# Altium schematic sheet 1.mcuv4.SchDoc
size A3; DocumentNumber: 2; SheetNumber: 2; SheetTotal: 4; PageSetup: Record=PageOptions|CenterHorizontal=True|CenterVertical=True|PrintScale=0.73|XCorrection=1.00|YCorrection=1.00|PrintKind=1|BorderSize=5000000|LeftOffset=0|BottomOffset=0|Orientation=2|PaperLength=1000|PaperWidth=1000|Scale=100|PaperSource=7|PrintQuality=-3|MediaType=1|DitherType=10|PrintScaleMode=1|PaperKind=A4|PaperIndex=9
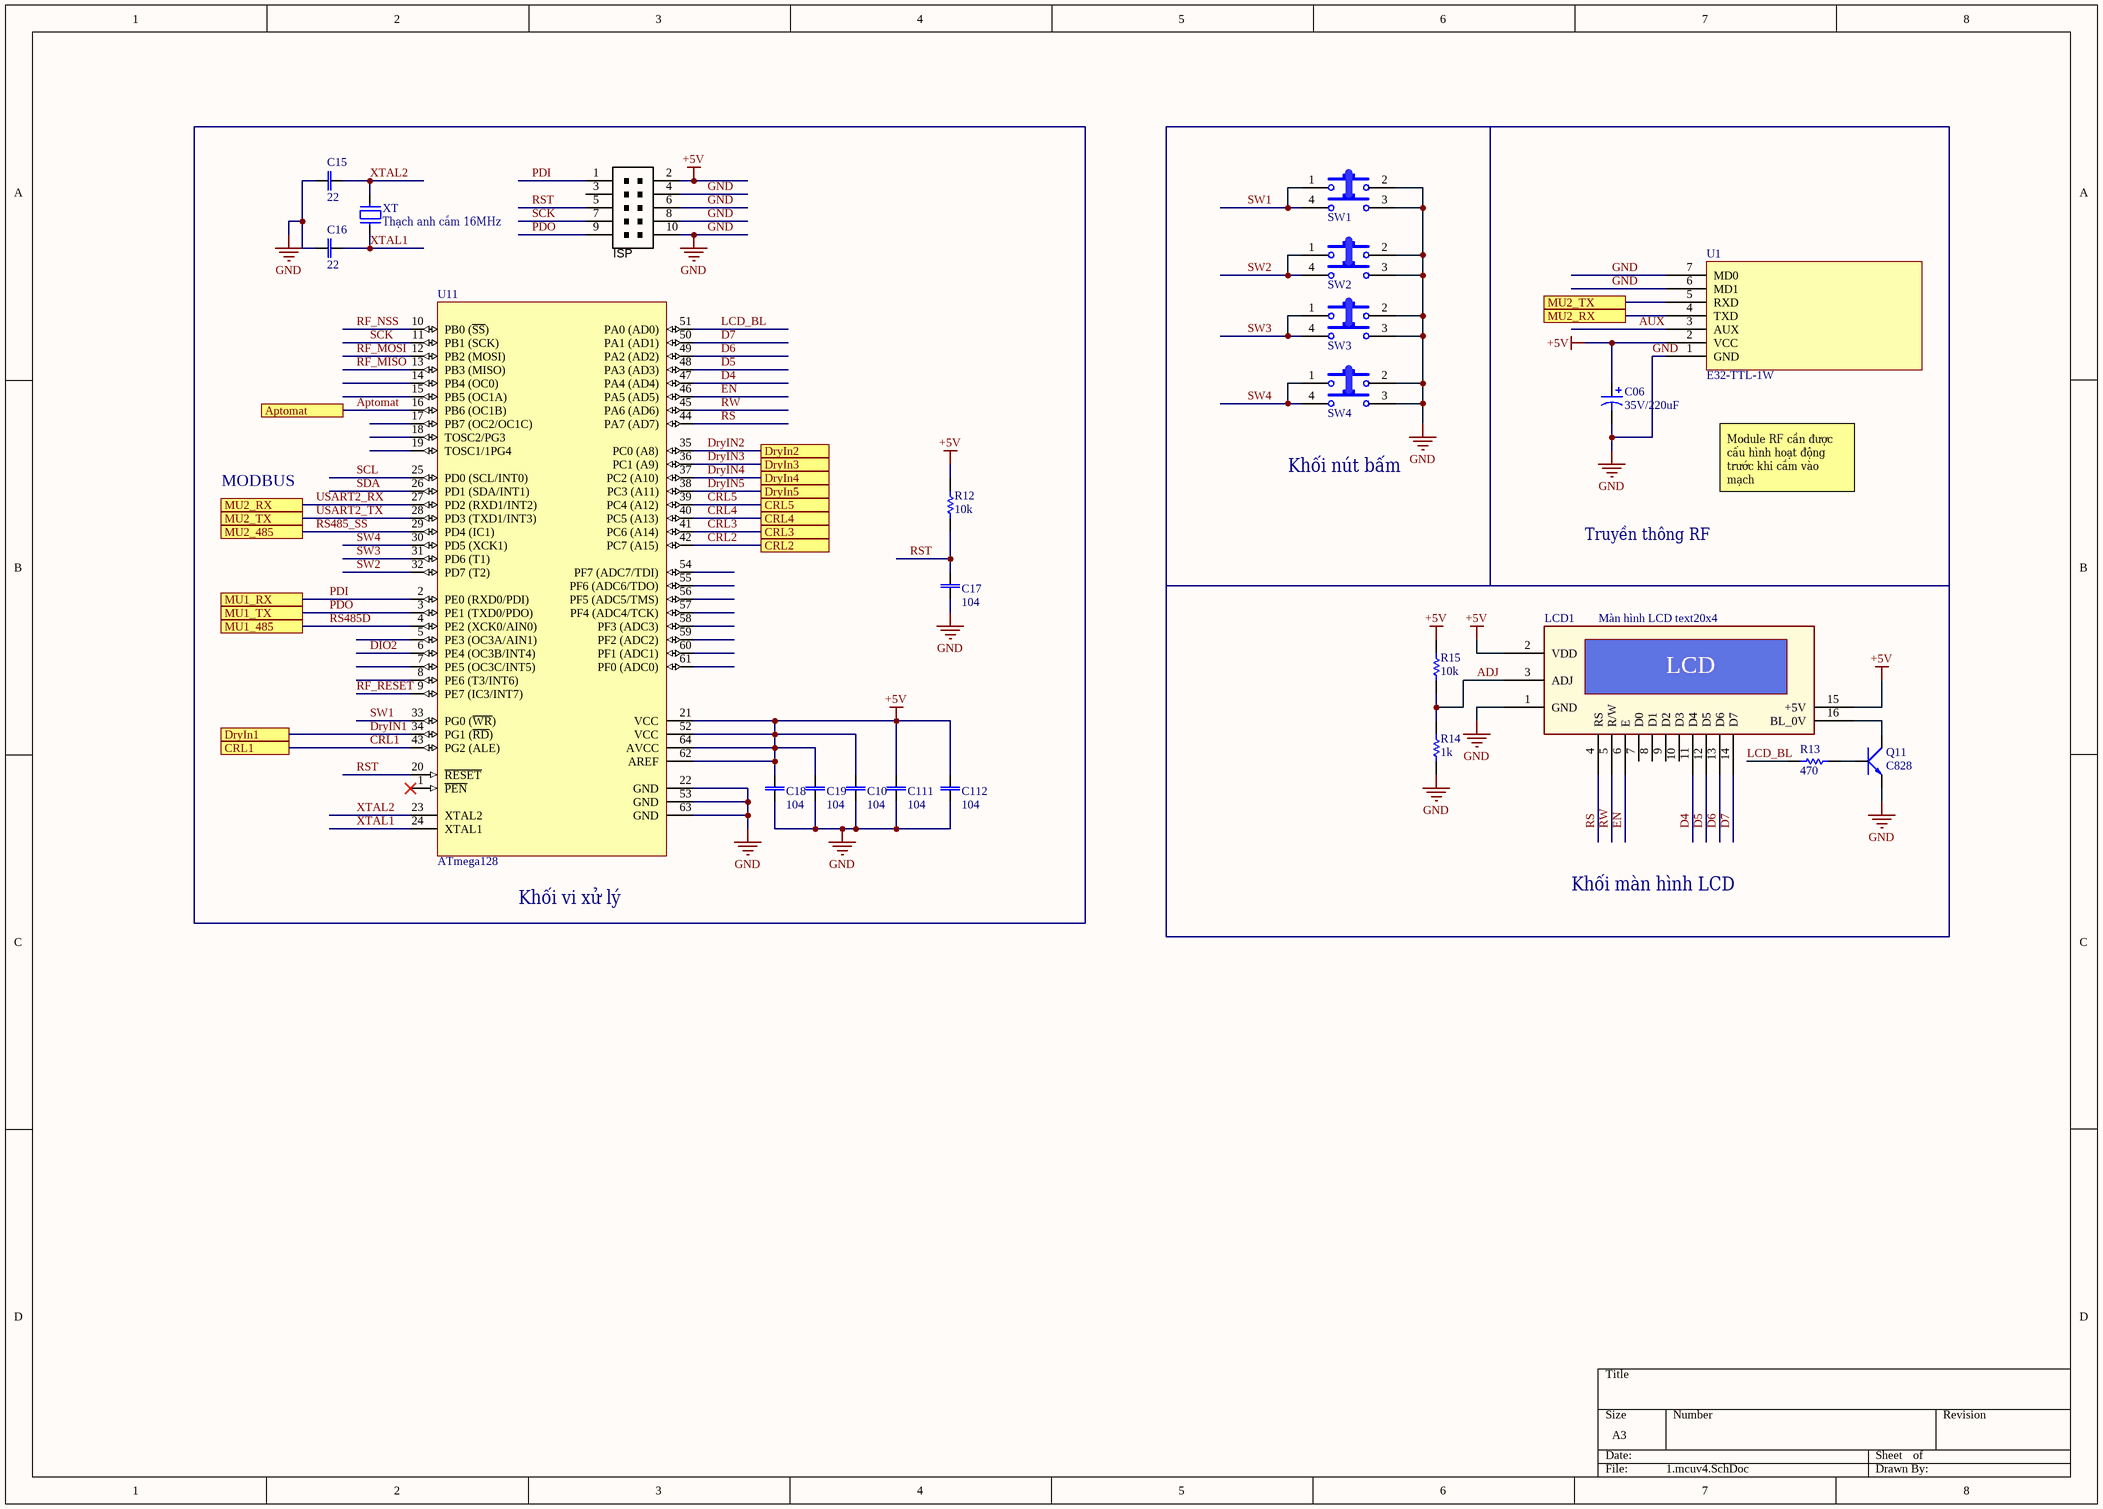
[diagram p0: 1.mcuv4.SchDoc]

## Parts
C06  value 35V/220uF  [CAPE3.5-5.0MM_Rad_10x14mm]  (hidden comment: Tụ nhôm cắm35V/220uF)
C10  value 104  [CAP 0805]  (hidden comment: Tụ điện dán 0805104)
C15  value 22  [CAP 0805]  (hidden comment: Tụ điện dán 080522)
C16  value 22  [CAP 0805]  (hidden comment: Tụ điện dán 080522)
C17  value 104  [CAP 0805]  (hidden comment: Tụ điện dán 0805104)
C18  value 104  [CAP 0805]  (hidden comment: Tụ điện dán 0805104)
C19  value 104  [CAP 0805]  (hidden comment: Tụ điện dán 0805104)
C111  value 104  [CAP 0805]  (hidden comment: Tụ điện dán 0805104)
C112  value 104  [CAP 0805]  (hidden comment: Tụ điện dán 0805104)
ISP  Giắc đôi 5x2 chân 2.54mm  [10P_PCB_HEADER_BRD_MNT]  (value not drawn)
LCD1  Màn hình LCD text20x4  [LCD 20x4]
Q11  C828  [SOT23 TOP]
R12  value 10k  [RES 0805]  (hidden comment: Điện trở dán 080510k)
R13  value 470  [RESC1608N_F]  (hidden comment: Điện trở dán 0805470)
R14  value 1k  [RES 0805]  (hidden comment: Điện trở dán 08051k)
R15  value 10k  [RES 0805]  (hidden comment: Điện trở dán 080510k)
SW1  Nút bấm 4 chân cắm12x12x17mm  [SW 12x12x4]  (value not drawn)
SW2  Nút bấm 4 chân cắm12x12x17mm  [SW 12x12x4]  (value not drawn)
SW3  Nút bấm 4 chân cắm12x12x17mm  [SW 12x12x4]  (value not drawn)
SW4  Nút bấm 4 chân cắm12x12x17mm  [SW 12x12x4]  (value not drawn)
U1  value E32-TTL-1W  [RF_AS32]
U11  ATmega128  [64A_N]
XT  Thạch anh cắm 16MHz  [XT2]

## Blocks framed on the sheet
Khối vi xử lý: C10 C15-C19 C111 C112 ISP R12 U11 XT

## Ports
Aptomat, CRL1, CRL2, CRL3, CRL4, CRL5, DryIn1, DryIn2, DryIn3, DryIn4, DryIn5, MU1_485, MU1_RX, MU1_TX, MU2_485, MU2_RX, MU2_TX

## Nets
+5V: C06.1 C10.2 C18.2 C19.2 C111.2 C112.2 ISP.2 LCD1.2(VDD) LCD1.15(+5V) R12.2 R15.2 U1.2(VCC) U11.21(VCC) U11.52(VCC) U11.62(AREF) U11.64(AVCC)
GND: C06.2 C10.1 C15.2 C16.2 C17.1 C18.1 C19.1 C111.1 C112.1 ISP.4 ISP.6 ISP.8 ISP.10 LCD1.1(GND) Q11.3(E) R14.1 SW1.2 SW1.3 SW2.2 SW2.3 SW3.2 SW3.3 SW4.2 SW4.3 U1.1(GND) U1.6(MD1) U1.7(MD0) U11.22(GND) U11.53(GND) U11.63(GND)
ADJ: LCD1.3(ADJ) R14.2 R15.1
Aptomat: U11.16(PB6_(OC1B)) ; port Aptomat
AUX: U1.3(AUX)
CRL1: U11.43(PG2_(ALE)) ; port CRL1
CRL2: U11.42(PC7_(A15)) ; port CRL2
CRL3: U11.41(PC6_(A14)) ; port CRL3
CRL4: U11.40(PC5_(A13)) ; port CRL4
CRL5: U11.39(PC4_(A12)) ; port CRL5
D4: LCD1.11(D4) U11.47(PA4_(AD4))
D5: LCD1.12(D5) U11.48(PA3_(AD3))
D6: LCD1.13(D6) U11.49(PA2_(AD2))
D7: LCD1.14(D7) U11.50(PA1_(AD1))
DIO2: U11.6(PE4_(OC3B/INT4))
DryIN1: U11.34(PG1_(~{RD})) ; port DryIn1
DryIN2: U11.35(PC0_(A8)) ; port DryIn2
DryIN3: U11.36(PC1_(A9)) ; port DryIn3
DryIN4: U11.37(PC2_(A10)) ; port DryIn4
DryIN5: U11.38(PC3_(A11)) ; port DryIn5
EN: LCD1.6(E) U11.46(PA5_(AD5))
LCD_BL: R13.2 U11.51(PA0_(AD0))
PDI: ISP.1 U11.2(PE0_(RXD0/PDI)) ; port MU1_RX
PDO: ISP.9 U11.3(PE1_(TXD0/PDO)) ; port MU1_TX
RF_MISO: U11.13(PB3_(MISO))
RF_MOSI: U11.12(PB2_(MOSI))
RF_NSS: U11.10(PB0_(~{SS}))
RF_RESET: U11.9(PE7_(IC3/INT7))
RS: LCD1.4(RS) U11.44(PA7_(AD7))
RS485_SS: U11.29(PD4_(IC1)) ; port MU2_485
RS485D: U11.4(PE2_(XCK0/AIN0)) ; port MU1_485
RST: C17.2 ISP.5 R12.1 U11.20(~{RESET})
RW: LCD1.5(R/W) U11.45(PA6_(AD6))
SCK: ISP.7 U11.11(PB1_(SCK))
SCL: U11.25(PD0_(SCL/INT0))
SDA: U11.26(PD1_(SDA/INT1))
SW1: SW1.1 SW1.4 U11.33(PG0_(~{WR}))
SW2: SW2.1 SW2.4 U11.32(PD7_(T2))
SW3: SW3.1 SW3.4 U11.31(PD6_(T1))
SW4: SW4.1 SW4.4 U11.30(PD5_(XCK1))
USART2_RX: U1.4(TXD) U11.27(PD2_(RXD1/INT2)) ; port MU2_RX
USART2_TX: U1.5(RXD) U11.28(PD3_(TXD1/INT3)) ; port MU2_TX
XTAL1: C16.1 U11.24(XTAL1) XT.1
XTAL2: C15.1 U11.23(XTAL2) XT.2
NetLCD1_16: LCD1.16(BL_0V) Q11.2(C)
NetQ11_1: Q11.1(B) R13.1

Not connected (* = marked no-connect by the designer): ISP 3; LCD1 7(D0) 8(D1) 9(D2) 10(D3); U11 1(~{PEN})* 5(PE3_(OC3A/AIN1)) 7(PE5_(OC3C/INT5)) 8(PE6_(T3/INT6)) 14(PB4_(OC0)) 15(PB5_(OC1A)) 17(PB7_(OC2/OC1C)) 18(TOSC2/PG3) 19(TOSC1/1PG4) 54(PF7_(ADC7/TDI)) 55(PF6_(ADC6/TDO)) 56(PF5_(ADC5/TMS)) 57(PF4_(ADC4/TCK)) 58(PF3_(ADC3)) 59(PF2_(ADC2)) 60(PF1_(ADC1)) 61(PF0_(ADC0))

## Notes on the sheet
- MODBUS
- (near SW4) Khối nút bấm
- Module RF cần được cấu hình hoạt động trước khi cắm vào mạch
- Truyền thông RF
- Khối màn hình LCD
- (in symbol LCD 16x2) LCD

## Library data of the parts
C06 = Cap: cm: Tụ nhôm cắm
C10 C15-C19 C111 C112 = CAP NP: Capacitor non polarized; cm1: Tụ điện dán 0603; cm3: Tụ điện dán 1206; cm2: Tụ điện dán 0805
ISP = CONN_HEADER_2x5P_0.100in_Male: Header THD 10 POS Double-row 2.54mm pitch; Manufacturer 1: 3M; Manufacturer Part Number 1: D2510-6002-AR; Pitch: 0.100" (2.54mm); Value: Double-row, 10 positions; QtyOverride: 1; Connector Type: Header, Shrouded; Number of Positions: 10; Package / Case: Connector header; 2.54mm pitch; Contact Type: Male Pin; Number of Rows: 2; Row Spacing: 0.100" (2.54mm); Contact Mating Length: 0.243" (6.17mm); ComponentLink1URL: http://multimedia.3m.com/mws/mediawebserver?66666UuZjcFSLXTtm8T_oxMcEVuQEcuZgVs6EVs6E666666--; ComponentLink1Description: http://multimedia.3m.com/mws/mediawebserver?66666UuZjcFSLXTtm8T_oxMcEVuQEcuZgVs6EVs6E666666--; Supplier 1: Digi-Key; Supplier Part Number 1: MHC10E-ND
LCD1 = LCD 16x2: Text LCD; vl1: 16x2; vl2: 20x4; cm1: Màn hình LCD text
Q11 = NPN: Transistor C828 C1815....
R12-R15 = Res: Resistor; cm1: Điện trở dán 0603; cm2: Điện trở cắm 1/4W; cm4: Điện trở dán 1206; cm3: Điện trở dán 0805
SW1-SW4 = SW-4P-Small: pin to pad: 3>2 4>1; cm1: Nút bấm 4 chân cắm; vl1: 12x12x17mm
U1 = AS32-TTL-1W: Type1: Module thu phát không dây RF
U11 = ATmega128-16AC: 8-Bit AVR Microcontroller with 128K Bytes of In-System Programmable Flash Memory; Published: 17-Sep-2003; LatestRevisionDate: 13-Apr-2006; LatestRevisionNote: IPC-7351 Footprint Added.; DatasheetVersion: 2467G-AVR-09/02; PackageVersion: revB, Oct-2001; PackageReference: 64A; Publisher: Altium Limited; PackageDescription: 64-Pin Thin Quad Flat Pack 0.8 mm Pitch; Code_JEDEC: MS-026-AEB; ComponentLink1Description: Manufacturer Link; ComponentLink1URL: http://www.atmel.com; ComponentLink2Description: Datasheet; ComponentLink2URL: http://www.atmel.com/dyn/resources/prod_documents/doc2467.pdf
XT = Crystal